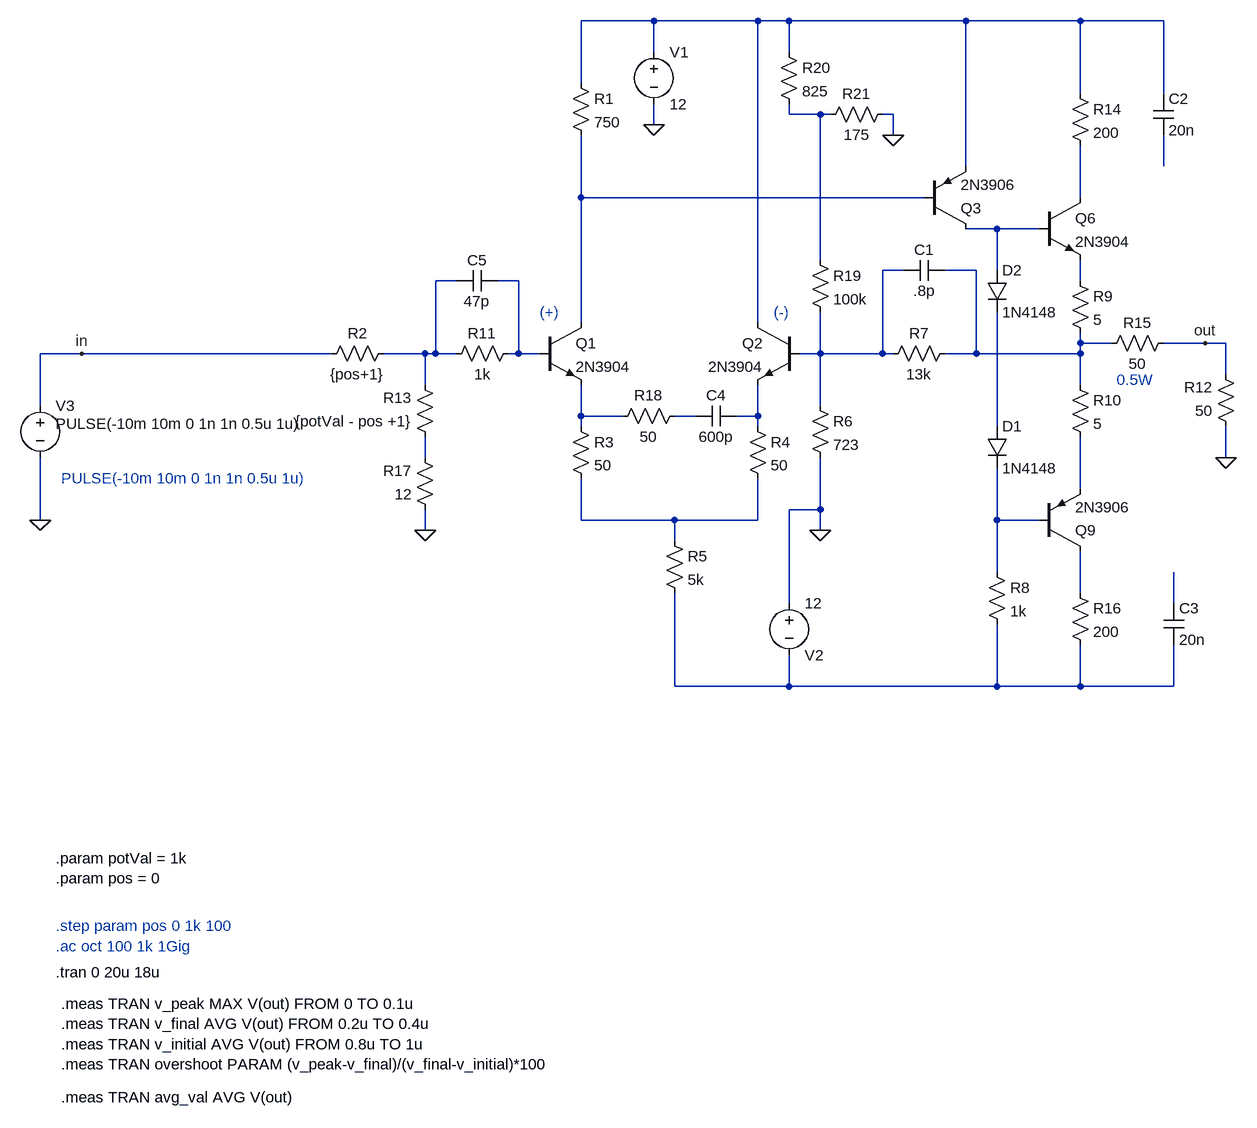
[diagram p0: schematic output amplifier.asc]
output amplifier.asc, the LTspice schematic file:
Version 4
SHEET 1 2216 1384
WIRE 192 -288 80 -288
WIRE 352 -288 192 -288
WIRE 400 -288 352 -288
WIRE 672 -288 400 -288
WIRE 848 -288 672 -288
WIRE 976 -288 848 -288
WIRE 192 -240 192 -288
WIRE 400 -240 400 -288
WIRE 80 -192 80 -288
WIRE 848 -176 848 -288
WIRE 976 -176 976 -288
WIRE 400 -144 400 -160
WIRE 448 -144 400 -144
WIRE 464 -144 448 -144
WIRE 560 -144 544 -144
WIRE 192 -128 192 -160
WIRE 560 -112 560 -144
WIRE 672 -64 672 -288
WIRE 976 -64 976 -112
WIRE 80 -16 80 -112
WIRE 608 -16 80 -16
WIRE 848 -16 848 -96
WIRE 720 32 672 32
WIRE 784 32 720 32
WIRE 448 80 448 -144
WIRE 576 96 544 96
WIRE 688 96 640 96
WIRE 720 96 720 32
WIRE -112 112 -144 112
WIRE -16 112 -48 112
WIRE 848 112 848 80
WIRE 80 176 80 -16
WIRE 352 176 352 -288
WIRE 848 208 848 192
WIRE 896 208 848 208
WIRE 1040 208 976 208
WIRE 1072 208 1040 208
WIRE -688 224 -752 224
WIRE -304 224 -688 224
WIRE -160 224 -224 224
WIRE -144 224 -144 112
WIRE -144 224 -160 224
WIRE -112 224 -144 224
WIRE -16 224 -16 112
WIRE -16 224 -32 224
WIRE 16 224 -16 224
WIRE 448 224 448 160
WIRE 448 224 416 224
WIRE 544 224 544 96
WIRE 544 224 448 224
WIRE 560 224 544 224
WIRE 688 224 688 96
WIRE 688 224 640 224
WIRE 848 224 848 208
WIRE 848 224 688 224
WIRE 1072 256 1072 208
WIRE -160 272 -160 224
WIRE 848 272 848 224
WIRE -752 304 -752 224
WIRE 448 304 448 224
WIRE 80 320 80 272
WIRE 144 320 80 320
WIRE 256 320 224 320
WIRE 352 320 352 272
WIRE 352 320 320 320
WIRE 80 336 80 320
WIRE 352 336 352 320
WIRE 720 336 720 160
WIRE -160 384 -160 352
WIRE 1072 384 1072 336
WIRE 848 432 848 352
WIRE 448 464 448 384
WIRE 448 464 400 464
WIRE -752 480 -752 384
WIRE 80 480 80 416
WIRE 224 480 80 480
WIRE 352 480 352 416
WIRE 352 480 224 480
WIRE 720 480 720 400
WIRE 784 480 720 480
WIRE -160 496 -160 464
WIRE 448 496 448 464
WIRE 224 512 224 480
WIRE 720 560 720 480
WIRE 848 592 848 528
WIRE 400 608 400 464
WIRE 992 608 992 560
WIRE 224 736 224 592
WIRE 400 736 400 688
WIRE 400 736 224 736
WIRE 720 736 720 640
WIRE 720 736 400 736
WIRE 848 736 848 672
WIRE 848 736 720 736
WIRE 992 736 992 672
WIRE 992 736 848 736
FLAG 192 -128 0
FLAG -752 480 0
FLAG 1040 208 out
FLAG -688 224 in
FLAG 448 496 0
FLAG -160 496 0
FLAG 1072 384 0
FLAG 560 -112 0
SYMBOL res 64 -208 R0
SYMATTR InstName R1
SYMATTR Value 750
SYMBOL res 64 320 R0
SYMATTR InstName R3
SYMATTR Value 50
SYMBOL res 336 320 R0
SYMATTR InstName R4
SYMATTR Value 50
SYMBOL npn 16 176 R0
SYMATTR InstName Q1
SYMATTR Value 2N3904
SYMBOL res 208 496 R0
SYMATTR InstName R5
SYMATTR Value 5k
SYMBOL npn 416 176 M0
SYMATTR InstName Q2
SYMATTR Value 2N3904
SYMBOL res 432 288 R0
SYMATTR InstName R6
SYMATTR Value 723
SYMBOL res 656 208 R90
WINDOW 0 0 56 VBottom 2
WINDOW 3 32 56 VTop 2
SYMATTR InstName R7
SYMATTR Value 13k
SYMBOL res 704 544 R0
SYMATTR InstName R8
SYMATTR Value 1k
SYMBOL npn 784 -16 R0
SYMATTR InstName Q6
SYMATTR Value 2N3904
SYMBOL pnp 784 528 M180
SYMATTR InstName Q9
SYMATTR Value 2N3906
SYMBOL res 832 96 R0
SYMATTR InstName R9
SYMATTR Value 5
SYMBOL res 832 256 R0
SYMATTR InstName R10
SYMATTR Value 5
SYMBOL res 1088 352 R180
WINDOW 0 36 76 Left 2
WINDOW 3 36 40 Left 2
SYMATTR InstName R12
SYMATTR Value 50
SYMBOL voltage 192 -256 R0
WINDOW 123 0 0 Left 0
WINDOW 39 0 0 Left 0
SYMATTR InstName V1
SYMATTR Value 12
SYMBOL voltage 400 592 R0
WINDOW 0 24 96 Left 2
WINDOW 3 24 16 Left 2
WINDOW 123 0 0 Left 0
WINDOW 39 0 0 Left 0
SYMATTR InstName V2
SYMATTR Value 12
SYMBOL pnp 608 32 M180
SYMATTR InstName Q3
SYMATTR Value 2N3906
SYMBOL res -16 208 R90
WINDOW 0 0 56 VBottom 2
WINDOW 3 32 56 VTop 2
SYMATTR InstName R11
SYMATTR Value 1k
SYMBOL res 992 192 R90
WINDOW 0 0 56 VBottom 2
WINDOW 3 32 56 VTop 2
SYMATTR InstName R15
SYMATTR Value 50
SYMBOL diode 704 336 R0
SYMATTR InstName D1
SYMATTR Value 1N4148
SYMBOL diode 704 96 R0
SYMATTR InstName D2
SYMATTR Value 1N4148
SYMBOL res 832 576 R0
SYMATTR InstName R16
SYMATTR Value 200
SYMBOL res 832 -192 R0
SYMATTR InstName R14
SYMATTR Value 200
SYMBOL cap 640 80 R90
WINDOW 0 0 32 VBottom 2
WINDOW 3 32 32 VTop 2
SYMATTR InstName C1
SYMATTR Value .8p
SYMBOL res -208 208 R90
WINDOW 0 0 56 VBottom 2
WINDOW 3 32 56 VTop 2
SYMATTR InstName R2
SYMATTR Value {pos+1}
SYMBOL res -144 368 R180
WINDOW 0 36 76 Left 2
WINDOW 3 36 40 Left 2
SYMATTR InstName R13
SYMATTR Value {potVal - pos +1}
SYMBOL res -144 480 R180
WINDOW 0 36 76 Left 2
WINDOW 3 36 40 Left 2
SYMATTR InstName R17
SYMATTR Value 12
SYMBOL cap 960 -176 R0
SYMATTR InstName C2
SYMATTR Value 20n
SYMBOL cap 976 608 R0
SYMATTR InstName C3
SYMATTR Value 20n
SYMBOL cap 320 304 R90
WINDOW 0 0 32 VBottom 2
WINDOW 3 32 32 VTop 2
SYMATTR InstName C4
SYMATTR Value 600p
SYMBOL res 240 304 R90
WINDOW 0 0 56 VBottom 2
WINDOW 3 32 56 VTop 2
SYMATTR InstName R18
SYMATTR Value 50
SYMBOL voltage -752 288 R0
WINDOW 3 24 44 Left 2
WINDOW 123 24 44 Left 2
WINDOW 39 0 0 Left 0
SYMATTR Value PULSE(-10m 10m 0 1n 1n 0.5u 1u)
SYMATTR InstName V3
SYMBOL res 432 64 R0
SYMATTR InstName R19
SYMATTR Value 100k
SYMBOL res 384 -256 R0
SYMATTR InstName R20
SYMATTR Value 825
SYMBOL res 560 -160 R90
WINDOW 0 0 56 VBottom 2
WINDOW 3 32 56 VTop 2
SYMATTR InstName R21
SYMATTR Value 175
SYMBOL cap -48 96 R90
WINDOW 0 0 32 VBottom 2
WINDOW 3 32 32 VTop 2
SYMATTR InstName C5
SYMATTR Value 47p
TEXT -728 1136 Left 2 ;.ac oct 100 1k 1Gig
TEXT 16 160 Left 2 ;(+)
TEXT 376 160 Left 2 ;(-)
TEXT 904 264 Left 2 ;0.5W
TEXT -728 1104 Left 2 ;.step param pos 0 1k 100
TEXT -728 1176 Left 2 !.tran 0 20u 18u
TEXT -728 1000 Left 2 !.param potVal = 1k\n.param pos = 0
TEXT -720 1224 Left 2 !.meas TRAN v_peak MAX V(out) FROM 0 TO 0.1u\n.meas TRAN v_final AVG V(out) FROM 0.2u TO 0.4u\n.meas TRAN v_initial AVG V(out) FROM 0.8u TO 1u\n.meas TRAN overshoot PARAM (v_peak-v_final)/(v_final-v_initial)*100
TEXT -720 1368 Left 2 !.meas TRAN avg_val AVG V(out)
TEXT -720 416 Left 2 ;PULSE(-10m 10m 0 1n 1n 0.5u 1u)

The netlist it stands for:
* output amplifier.asc
R1 N001 N004 750
R3 N012 N018 50
R4 N014 N018 50
Q1 N004 N010 N012 0 2N3904
R5 N018 N022 5k
Q2 N001 N007 N014 0 2N3904
R6 N007 0 723
R7 N008 N007 13k
R8 N019 N022 1k
Q6 N005 N006 N011 0 2N3904
Q9 N020 N019 N017 0 2N3906
R9 N011 N008 5
R10 N008 N017 5
R12 0 out 50
V1 N001 0 12
V2 0 N022 12
Q3 N006 N004 N001 0 2N3906
R11 N010 N009 1k
R15 out N008 50
D1 N015 N019 1N4148
D2 N006 N015 1N4148
R16 N020 N022 200
R14 N001 N005 200
C1 N008 N007 .8p
R2 N009 in {pos+1}
R13 N016 N009 {potVal - pos +1}
R17 0 N016 12
C2 N001 N003 20n
C3 N021 N022 20n
C4 N014 N013 600p
R18 N013 N012 50
V3 in 0 PULSE(-10m 10m 0 1n 1n 0.5u 1u)
R19 N002 N007 100k
R20 N001 N002 825
R21 0 N002 175
C5 N010 N009 47p
.model D D
.lib standard.dio
.model NPN NPN
.model PNP PNP
.lib standard.bjt
* .ac oct 100 1k 1Gig
* (+)
* (-)
* 0.5W
* .step param pos 0 1k 100
.tran 0 20u 18u
.param potVal = 1k
.param pos = 0
.meas TRAN v_peak MAX V(out) FROM 0 TO 0.1u
.meas TRAN v_final AVG V(out) FROM 0.2u TO 0.4u
.meas TRAN v_initial AVG V(out) FROM 0.8u TO 1u
.meas TRAN overshoot PARAM (v_peak-v_final)/(v_final-v_initial)*100
.meas TRAN avg_val AVG V(out)
* PULSE(-10m 10m 0 1n 1n 0.5u 1u)
.backanno
.end